# EAGLE design StepTruck_Esquematico (EAGLE 9.6.2)
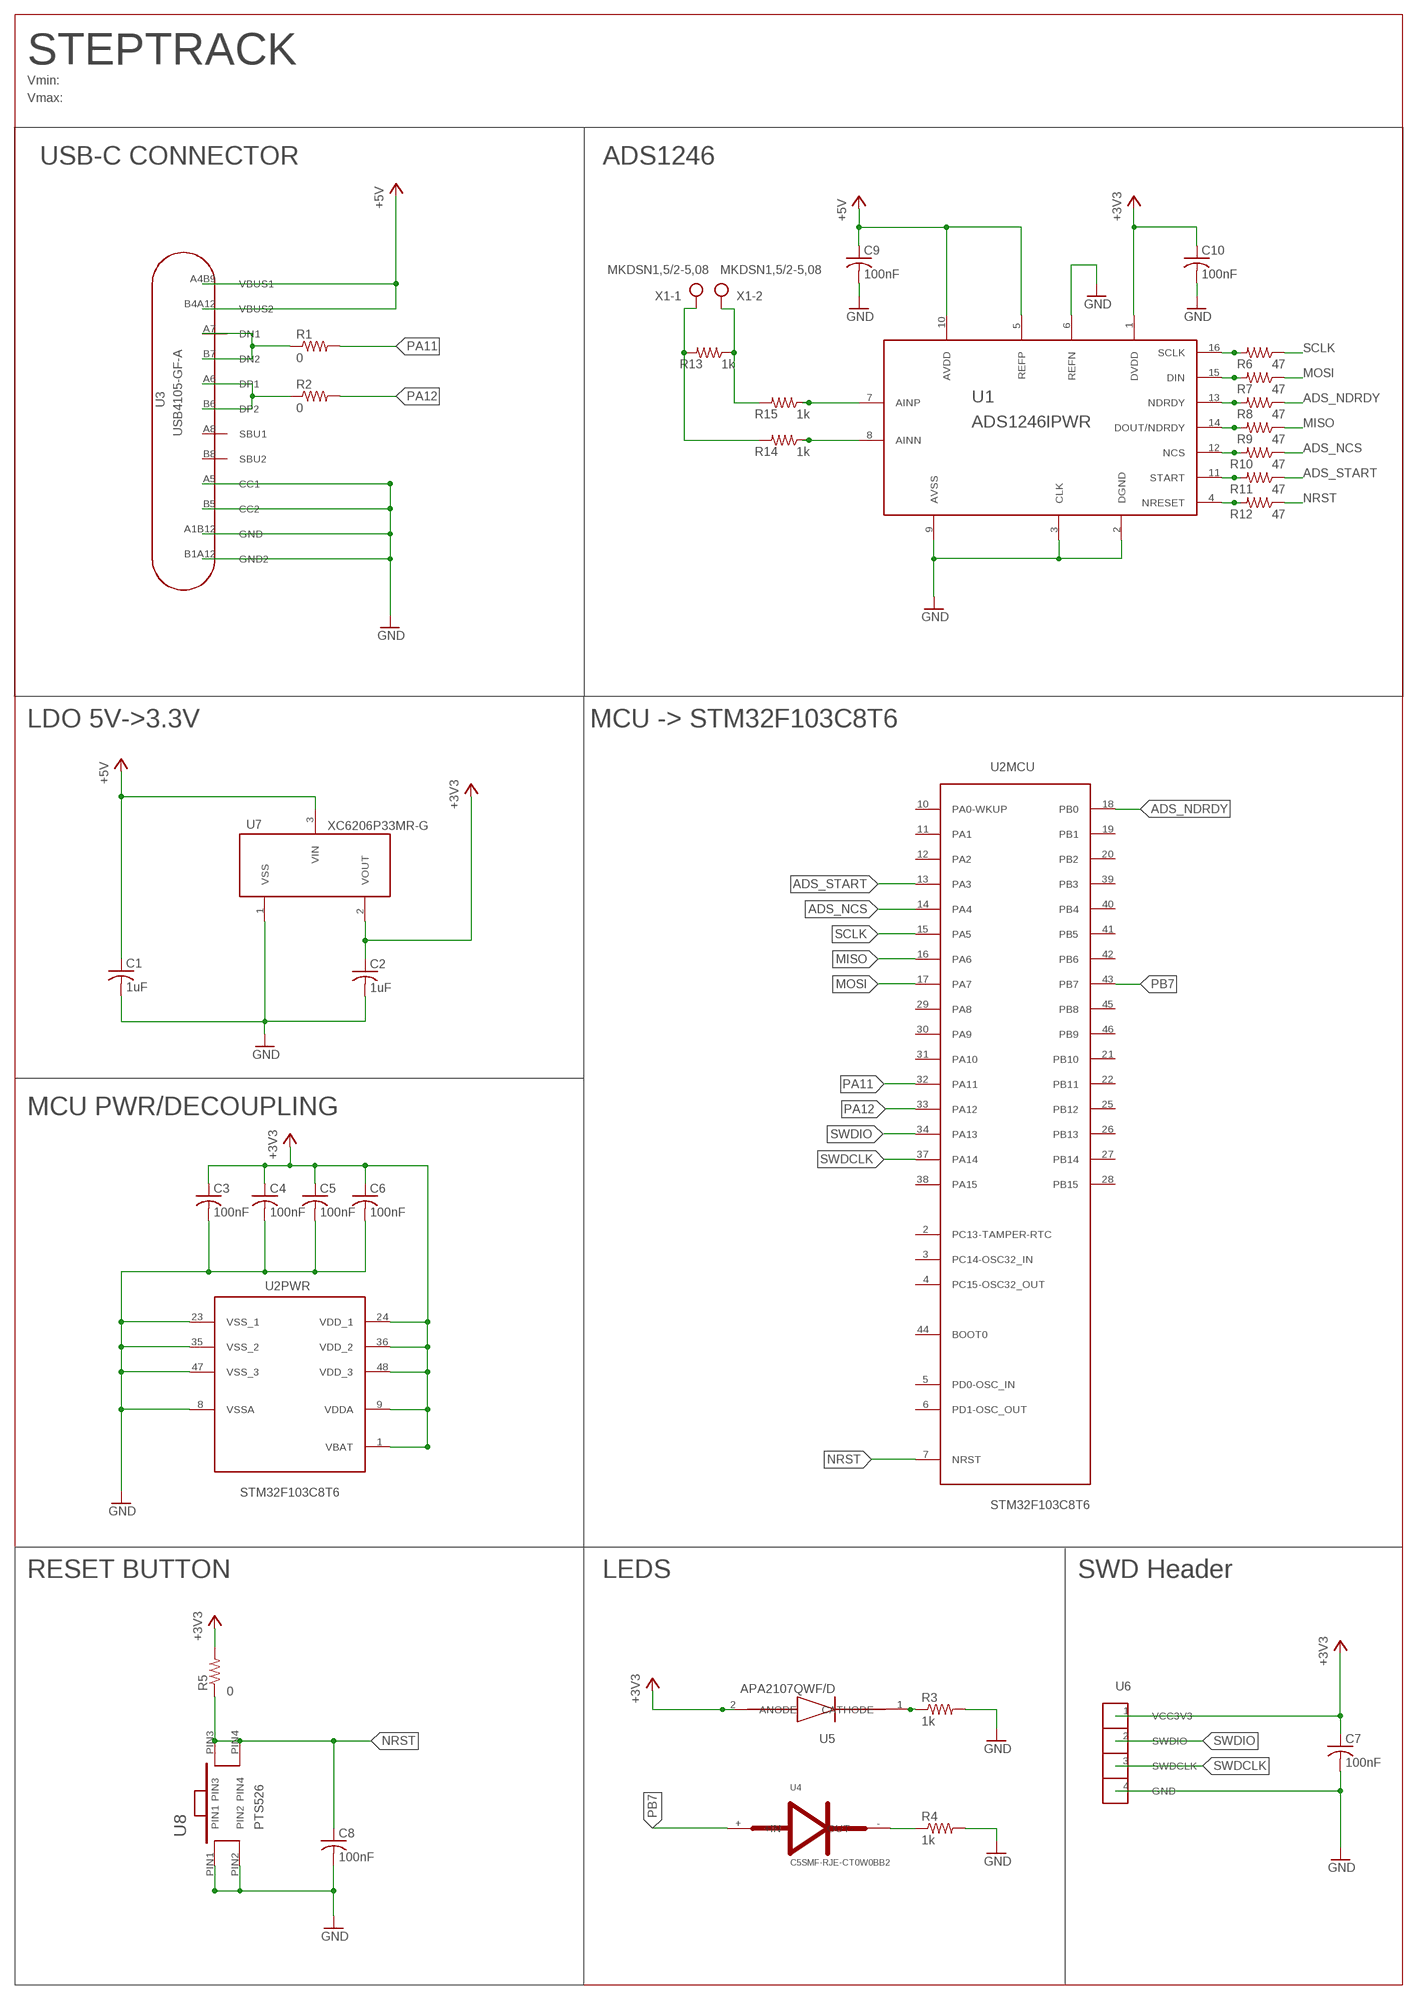
[diagram p0: schematic, sheet 1]

## Parts
C1  1uF  C-USC0805K  [C0805K]
C2  1uF  C-USC0805K  [C0805K]
C3  100nF  C-USC0805K  [C0805K]
C4  100nF  C-USC0805K  [C0805K]
C5  100nF  C-USC0805K  [C0805K]
C6  100nF  C-USC0805K  [C0805K]
C7  100nF  C-USC0805K  [C0805K]
C8  100nF  C-USC0805K  [C0805K]
C9  100nF  C-USC0805K  [C0805K]
C10  100nF  C-USC0805K  [C0805K]
R1  0  R-US_R0805  [R0805]
R2  0  R-US_R0805  [R0805]
R3  1k  R-US_R0805  [R0805]
R4  1k  R-US_R0805  [R0805]
R5  0  R-US_R0805  [R0805]
R6  47  R-US_R0805  [R0805]
R7  47  R-US_R0805  [R0805]
R8  47  R-US_R0805  [R0805]
R9  47  R-US_R0805  [R0805]
R10  47  R-US_R0805  [R0805]
R11  47  R-US_R0805  [R0805]
R12  47  R-US_R0805  [R0805]
R13  1k  R-US_R0805  [R0805]
R14  1k  R-US_R0805  [R0805]
R15  1k  R-US_R0805  [R0805]
U1  ADS1246IPWR  [ADS1246IPWR]
U2  STM32F103C8T6  [48-LQFP]
U3  USB4105-GF-A  [USB4105-GF-A]
U4  C5SMF-RJE-CT0W0BB2  [C5SMF-RJE-CT0W0BB2]
U5  APA2107QWF/D  [APA2107QWF/D]
U6  TS104TAA  [TS-104-T-AA]
U7  XC6206P33MR-G  [SOT-23]
U8  PTS526  [PTS526]
X1  MKDSN1,5/2-5,08  [MKDSN1,5/2-5,08]

## Nets
+3V3: C2.1 C3.1 C4.1 C5.1 C6.1 C7.1 C10.1 R5.2 U1.1(DVDD) U2.1(PWR:VBAT) U2.9(PWR:VDDA) U2.24(PWR:VDD_1) U2.36(PWR:VDD_2) U2.48(PWR:VDD_3) U5.2(ANODE) U6.1(VCC3V3) U7.2(VOUT)
+5V: C1.1 C9.1 U1.5(REFP) U1.10(AVDD) U3.A4B9(VBUS1) U3.B4A12(VBUS2) U7.3(VIN)
ADS_NCS: R10.1 U2.14(MCU:PA4)
ADS_NDRDY: R8.1 U2.18(MCU:PB0)
ADS_START: R11.1 U2.13(MCU:PA3)
GND: C1.2 C2.2 C3.2 C4.2 C5.2 C6.2 C7.2 C8.2 C9.2 C10.2 R3.2 R4.2 U1.2(DGND) U1.3(CLK) U1.6(REFN) U1.9(AVSS) U2.8(PWR:VSSA) U2.23(PWR:VSS_1) U2.35(PWR:VSS_2) U2.47(PWR:VSS_3) U3.A1B12(GND) U3.A5(CC1) U3.B1A12(GND2) U3.B5(CC2) U6.4(GND) U7.1(VSS) U8.PIN1 U8.PIN2
MISO: R9.1 U2.16(MCU:PA6)
MOSI: R7.1 U2.17(MCU:PA7)
N$1: R1.1 U3.A7(DN1) U3.B7(DN2)
N$2: R15.1 U1.7(AINP)
N$3: R2.1 U3.A6(DP1) U3.B6(DP2)
N$4: R14.1 U1.8(AINN)
N$5: R3.1 U5.1(CATHODE)
N$6: R4.1 U4.-(OUT-)
N$7: R12.2 U1.4(NRESET)
N$8: R11.2 U1.11(START)
N$9: R10.2 U1.12(NCS)
N$10: R9.2 U1.14(DOUT/NDRDY)
N$11: R8.2 U1.13(NDRDY)
N$12: R7.2 U1.15(DIN)
N$13: R6.2 U1.16(SCLK)
N$14: R13.2 R14.2 X1.1
N$17: R13.1 R15.2 X1.2
NRST: C8.1 R5.1 R12.1 U2.7(MCU:NRST) U8.PIN3 U8.PIN4
PA11 [New Class]: R1.2 U2.32(MCU:PA11)
PA12: R2.2 U2.33(MCU:PA12)
PB7: U2.43(MCU:PB7) U4.+(+IN)
SCLK [New Class]: R6.1 U2.15(MCU:PA5)
SWDCLK: U2.37(MCU:PA14) U6.3(SWDCLK)
SWDIO: U2.34(MCU:PA13) U6.2(SWDIO)
Unconnected: U2.2(MCU:PC13-TAMPER-RTC) U2.3(MCU:PC14-OSC32_IN) U2.4(MCU:PC15-OSC32_OUT) U2.5(MCU:PD0-OSC_IN) U2.6(MCU:PD1-OSC_OUT) U2.10(MCU:PA0-WKUP) U2.11(MCU:PA1) U2.12(MCU:PA2) U2.19(MCU:PB1) U2.20(MCU:PB2) U2.21(MCU:PB10) U2.22(MCU:PB11) U2.25(MCU:PB12) U2.26(MCU:PB13) U2.27(MCU:PB14) U2.28(MCU:PB15) U2.29(MCU:PA8) U2.30(MCU:PA9) U2.31(MCU:PA10) U2.38(MCU:PA15) U2.39(MCU:PB3) U2.40(MCU:PB4) U2.41(MCU:PB5) U2.42(MCU:PB6) U2.44(MCU:BOOT0) U2.45(MCU:PB8) U2.46(MCU:PB9) U3.A8(SBU1) U3.B8(SBU2)

## Notes on the sheet
- STEPTRACK
- Vmin:
- Vmax:
- USB-C CONNECTOR | ADS1246
- LDO 5V->3.3V | MCU -> STM32F103C8T6
- MCU PWR/DECOUPLING
- RESET BUTTON | LEDS | SWD Header

## Library data of the parts
C1-C10 = rcl:C-US: CAPACITOR, American symbol; SPICEPREFIX: C
R1-R15 = rcl:R-US_: RESISTOR, American symbol; SPICEPREFIX: R
U1 = ADS1246:ADS1246IPWR
U2 = STM32F103C8T6 - STM:STM32F103C8T6
U3 = USB4105:USB4105-GF-A
U4 = LED_ROJO:C5SMF-RJE-CT0W0BB2
U5 = LED_BLANCO:APA2107QWF/D
U6 = SWD:TS104TAA
U7 = XC6206P332MR-G-TS:XC6206P33MR-G
U8 = PTS526:PTS526
X1 = 1729128 - PHOENIX CONTACT:MKDSN1,5/2-5,08: MKDSN 1,5/ 2-5,08 Printklemme Nennstrom: 13,5 A Nennspannung: 250 V Rastermaß: 5,08 mm Polzahl: 2 Anschlussart: Schraubanschluss Montage: Löten Anschlussrichtung Leiter/Platine: 0 ° Artikelnummer: 1729128 Source: http://eshop.phoenixcontact.com .. 1729128.pdf

## Board
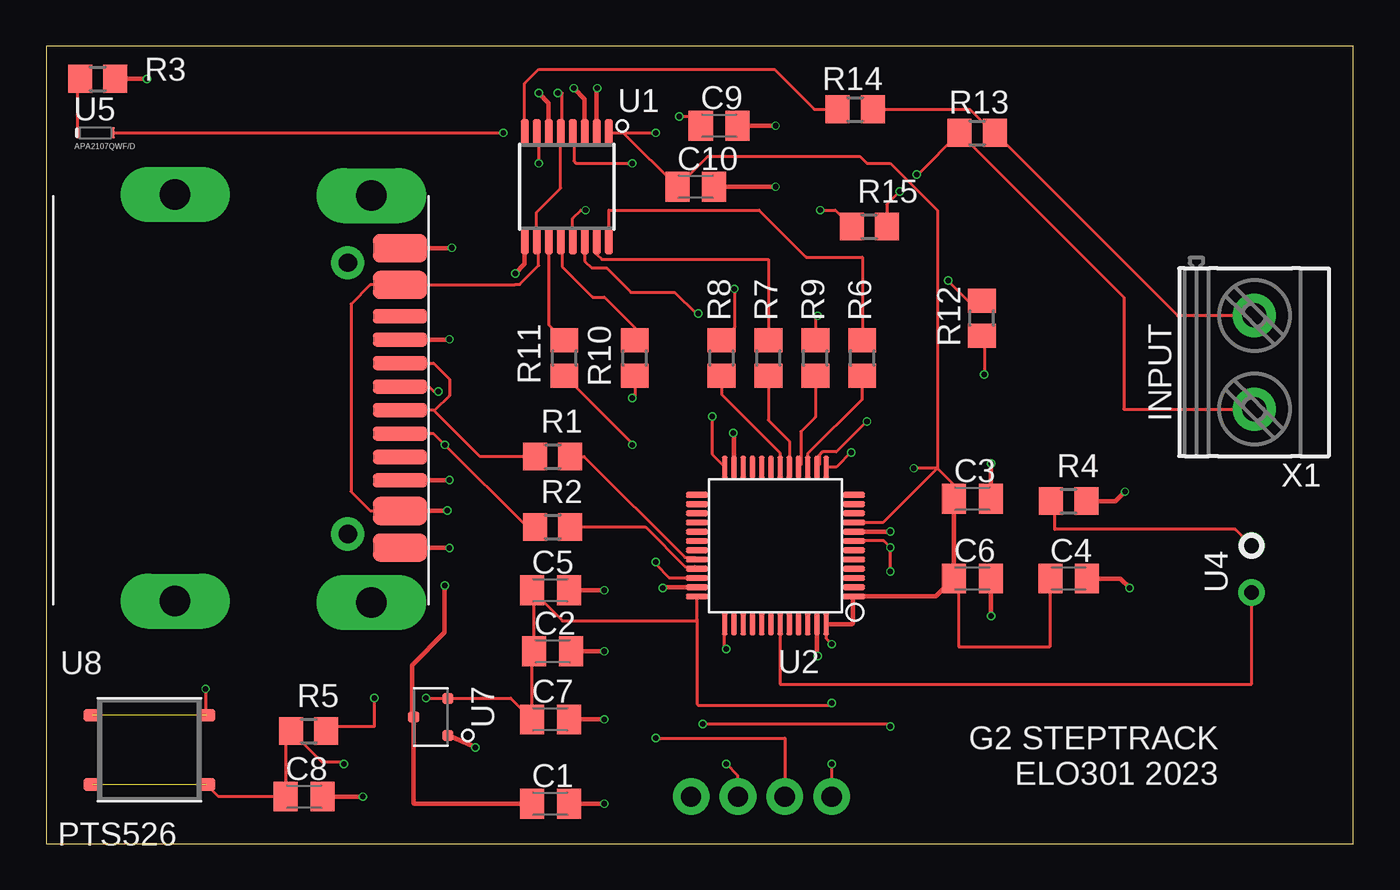
[diagram p1: board, top side]
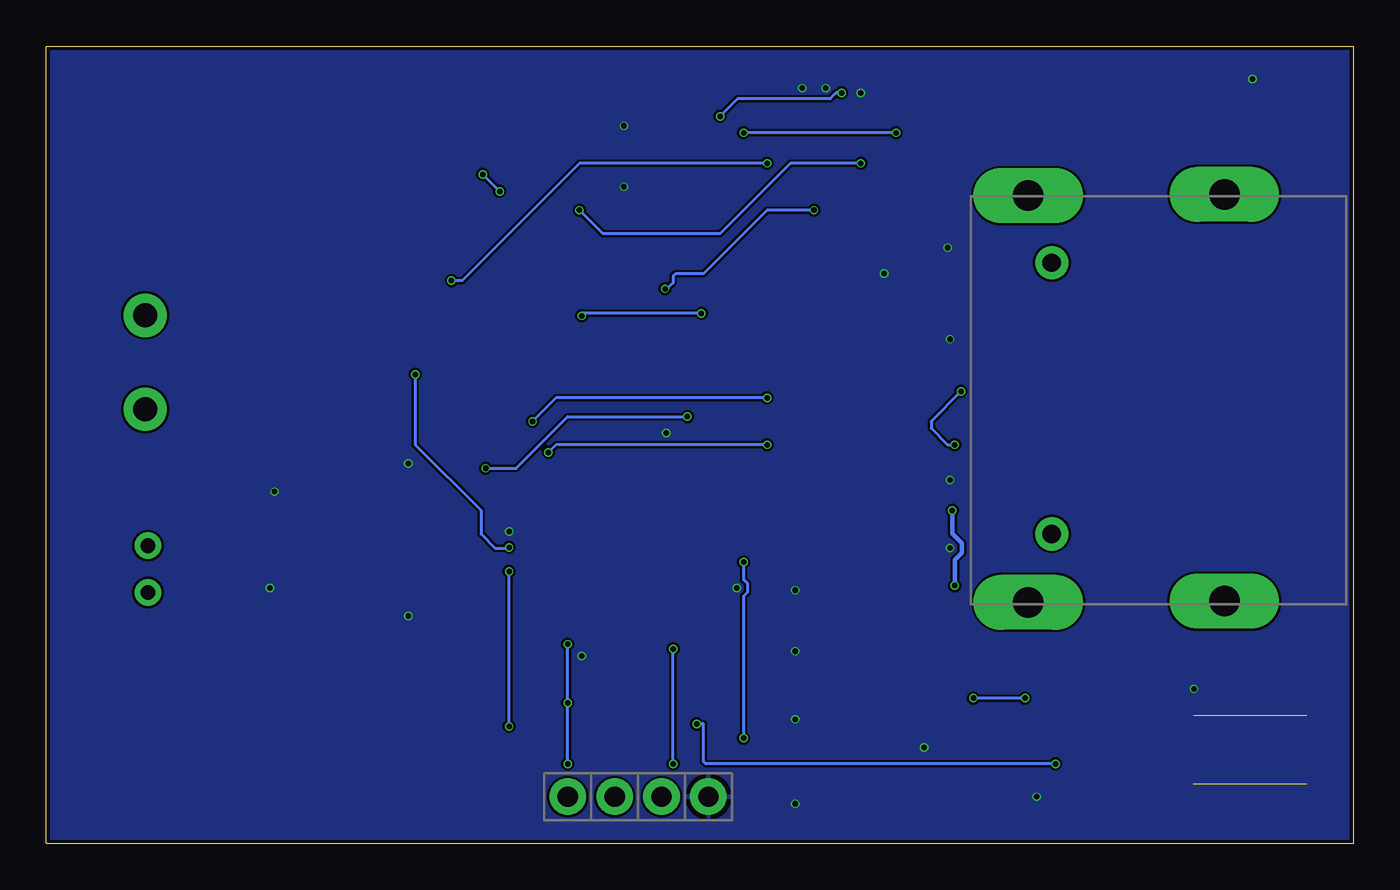
[diagram p2: board, bottom side, seen from below]

Size 70.79 x 43.17 mm. Coordinates in mm from the lower left corner, seen from the top.
Outline: 0,0 70.79,0 70.79,43.17 0,43.17 0,0
Copper layers (1*16): Top 0.035mm / dielectric 1.6mm / Bottom 0.035mm
Design rules "jlcpcb-2layers": minimum track width 5mil, minimum drill 0.3mm, track to track 5mil, track to pad 5mil, pad to pad 5mil, via to via 5mil, smd to smd 5mil, copper to edge 0.2mm, drill to drill 6mil, minimum pad ring 10mil, minimum via ring 3mil, stop-mask expansion 4mil, vias tented up to drill 0mil, thermal gap 10mil

### Footprints (pad centres in the part's own frame; a part is rotated, then mirrored left to right if it is on the bottom)
C0805K = smd 1.3 x 1.6: 1 -1,0; 2 1,0
R0805 = smd 1.3 x 1.5: 1 -0.95,0; 2 0.95,0
ADS1246IPWR = smd 1.5 x 0.45: 1 -2.9,2.275; 2 -2.9,1.625; 3 -2.9,0.975; 4 -2.9,0.325; 5 -2.9,-0.325; 6 -2.9,-0.975; 7 -2.9,-1.625; 8 -2.9,-2.275; 9 2.9,-2.275; 10 2.9,-1.625; 11 2.9,-0.975; 12 2.9,-0.325; 13 2.9,0.325; 14 2.9,0.975; 15 2.9,1.625; 16 2.9,2.275
48-LQFP = smd 1.2 x 0.3: 1 -4.25,2.75; 2 -4.25,2.25; 3 -4.25,1.75; 4 -4.25,1.25; 5 -4.25,0.75; 6 -4.25,0.25; 7 -4.25,-0.25; 8 -4.25,-0.75; 9 -4.25,-1.25; 10 -4.25,-1.75; 11 -4.25,-2.25; 12 -4.25,-2.75; 25 4.25,-2.75; 26 4.25,-2.25; 27 4.25,-1.75; 28 4.25,-1.25; 29 4.25,-0.75; 30 4.25,-0.25; 31 4.25,0.25; 32 4.25,0.75; 33 4.25,1.25; 34 4.25,1.75; 35 4.25,2.25; 36 4.25,2.75 | smd 0.3 x 1.2: 13 -2.75,-4.25; 14 -2.25,-4.25; 15 -1.75,-4.25; 16 -1.25,-4.25; 17 -0.75,-4.25; 18 -0.25,-4.25; 19 0.25,-4.25; 20 0.75,-4.25; 21 1.25,-4.25; 22 1.75,-4.25; 23 2.25,-4.25; 24 2.75,-4.25; 37 2.75,4.25; 38 2.25,4.25; 39 1.75,4.25; 40 1.25,4.25; 41 0.75,4.25; 42 0.25,4.25; 43 -0.25,4.25; 44 -0.75,4.25; 45 -1.25,4.25; 46 -1.75,4.25; 47 -2.25,4.25; 48 -2.75,4.25
USB4105-GF-A = drill 1.651 pad 1.93 long: 1 -11.024,-2.032; 2 -10.947,8.585; 5 11.074,8.585; 6 10.998,-2.032 | drill 1 pad 1.676: 3 -7.315,7.315; 4 7.366,7.315 | smd 1.524 x 2.921: A1B12 -8.103,10.147; A4B9 -6.121,10.147; B1A12 8.103,10.147; B4A12 6.121,10.147 | smd 0.762 x 2.921: A5 -3.15,10.147; A6 -0.61,10.147; A7 0.66,10.147; A8 3.2,10.147; B5 4.47,10.147; B6 1.93,10.147; B7 -1.88,10.147; B8 -4.42,10.147
C5SMF-RJE-CT0W0BB2 = drill 0.8 pad 1.4: + -1.27,0; - 1.27,0
APA2107QWF/D = smd 0.2 x 0.6: 1 -0.95,0; 2 0.95,0
TS-104-T-AA = drill 1.1 pad 1.85: 1 0,3.81; 2 0,1.27; 3 0,-1.27; 4 0,-3.81
SOT-23 = smd 0.6 x 0.6: 1 -1,-0.93; 2 1,-0.93; 3 0,0.93
PTS526 = smd 1 x 0.7: PIN1 -3.073,1.869; PIN2 3.073,1.869; PIN3 -3.073,-1.869; PIN4 3.073,-1.869
MKDSN1,5/2-5,08 = drill 1.3 pad 2: 1 -2.561,0.025; 2 2.519,0.025

### Placement (x,y rotation side)
C1  27.3,2.16 0 top
C2  27.43,10.41 0 top
C3  50.16,18.67 0 top
C4  55.37,14.35 0 top
C5  27.3,13.72 0 top
C6  50.16,14.35 0 top
C7  27.3,6.73 0 top
C8  13.97,2.54 0 top
C9  36.45,38.86 0 top
C10  35.18,35.56 0 top
R1  27.43,20.95 0 top
R2  27.43,17.14 0 top
R3  2.79,41.4 0 top
R4  55.37,18.54 0 top
R5  14.22,6.1 0 top
R6  44.2,26.29 90 top
R7  39.12,26.29 90 top
R8  36.58,26.29 90 top
R9  41.66,26.29 90 top
R10  31.88,26.29 90 top
R11  28.07,26.29 90 top
R12  50.67,28.45 90 top
R13  50.42,38.48 0 top
R14  43.81,39.75 0 top
R15  44.58,33.4 0 top
U1  28.19,35.56 270 top
U2  39.5,16.13 180 top
U3  9.02,24.13 270 top
U4  65.28,14.86 90 top
U5  2.67,38.48 0 top
U6  38.73,2.54 270 top
U7  20.83,6.86 90 top
U8  5.59,5.08 0 top
X1  65.41,26.03 270 top

### Tracks (layer width: path | path; a pad name or v marks a point on that pad's centre or on a via)
+3V3  (via drill 0.3)
  Top 0.152: 31.28,38.46 C10.1 35.83,37.21 44.07,37.21 44.45,36.83 45.72,36.83 48.26,34.29 48.26,20.32 | 31.28,38.46 U1.1 | 48.26,20.32 49.53,19.05 49.53,19.03 C3.1 | U2.9 45.32,17.38 48.26,20.32 | 48.26,20.32 v46.99,20.32 | U2.24 36.75,20.4 36.07,21.08 v36.07,23.11 | v42.55,10.79 42.25,11.09 U2.48 | U6.1 v42.55,4.32 | C6.1 49.4,14.11 49.4,10.67 54.36,10.67 54.37,10.68 C4.1 | R5.2 15.43,6.35 17.78,6.35 v17.78,7.87 | U5.2 v24.77,38.48 | v33.02,38.48 33,38.46 31.28,38.46 | 35.25,12.13 35.18,12.06 27.96,12.06 C5.1 26.43,13.59 C2.1 26.3,10.29 C7.1 25.16,7.87 23.62,7.87 23.61,7.86 U7.2 21.74,7.87 v20.57,7.87 | 35.25,12.13 U2.36 | 35.25,12.13 35.25,7.55 35.31,7.49 42.55,7.49 v42.55,7.62
  Top 0.254: C3.1 C6.1 48.19,13.38 U2.1 43.69,13.32 43.69,11.94 43.63,11.88 U2.48
  Bottom 0.152: v46.99,20.32 45.34,20.32 42.55,23.11 v36.07,23.11 | v42.55,4.32 v42.55,7.62 v42.55,10.79 | v24.77,38.48 v33.02,38.48 | v17.78,7.87 v20.57,7.87
+5V  (via drill 0.3)
  Top 0.152: v27.72,40.64 27.94,40.64 27.94,38.53 U1.5 27.87,35.49 26.57,34.19 U1.10 26.67,32.56 26.67,31.31 25.64,30.28 25.4,30.28 25.37,30.25 U3.A4B9 17.55,30.25 16.51,29.21 16.51,19.05 17.55,18.01 U3.B4A12 | v34.29,39.37 34.94,39.37 C9.1
  Top 0.254: U3.B4A12 21.69,18.01 v21.72,18.03 | v21.59,13.97 21.59,11.43 19.81,9.65 19.81,6.94 U7.3 19.9,2.2 19.94,2.16 C1.1
  Bottom 0.152: v27.72,40.64 28.01,40.64 28.33,40.31 33.35,40.31 v34.29,39.37
  Bottom 0.254: v21.72,18.03 21.72,16.77 21.21,16.26 21.21,15.74 21.59,15.36 v21.59,13.97
ADS_NCS  (via drill 0.3)
  Top 0.152: R10.1 31.88,24.26 v31.75,24.13 | v44.45,22.86 42.8,21.21 42.05,21.21 41.87,21.03 41.87,20.5 U2.14
  Bottom 0.152: v31.75,24.13 43.18,24.13 v44.45,22.86
ADS_NDRDY
  Top 0.152: R8.1 36.58,24.32 39.75,21.15 U2.18
ADS_START  (via drill 0.3)
  Top 0.152: R11.1 31.75,21.66 v31.75,21.59 | v43.59,21.18 42.79,20.38 U2.13
  Bottom 0.152: v43.59,21.18 43.18,21.59 v31.75,21.59
GND  (via drill 0.3)  (1 unrouted)
  Top 0.152: U8.PIN2 8.66,8.23 8.64,8.25 v8.64,8.38
  Top 0.254: R3.2 v5.46,41.4 | U1.6 27.22,40.09 v26.67,40.64 | U1.3 29.17,40.3 v28.57,40.89 | U1.2 29.82,40.87 v29.84,40.89 | U1.9 25.92,31.38 v25.4,30.86 | C9.2 v39.5,38.86 | C10.2 v39.5,35.56 | U3.A1B12 21.95,32.23 v21.97,32.26 | U3.A5 21.82,27.28 v21.84,27.3 | U3.B5 21.82,19.66 v21.84,19.69 | U3.B1A12 21.82,16.03 v21.84,16 | R4.2 57.91,18.54 v58.42,19.05 | C4.2 58.17,14.35 v58.67,13.84 | C3.2 51.16,20.56 v51.18,20.57 | C6.2 51.16,12.33 v51.18,12.32 | C5.2 v30.23,13.72 | C2.2 v30.23,10.41 | C7.2 v30.23,6.73 | C1.2 v30.23,2.16 | U7.1 23.2,5.25 v23.24,5.21 | C8.2 v17.14,2.54 | U2.23 37.25,22.19 v37.21,22.23 | U2.8 45.71,16.88 v45.72,16.89 | U2.47 41.75,10.2 v41.78,10.16 | U2.35 33.44,13.88 v33.4,13.84
  pour Bottom: 0,43.18 69.85,43.18 70.74,43.18 70.87,43.05 70.87,0 70.99,-0.13 0,-0.13
MISO
  Top 0.152: U2.16 40.87,20.5 40.87,22.3 41.66,23.09 R9.1
MOSI
  Top 0.152: R7.1 39.12,22.93 40.25,21.8 U2.17
N$1
  Top 0.152: R1.1 23.5,20.95 21.02,23.43 | U3.A7 20.98,23.47 21.02,23.43 | U3.B7 20.98,26.01 21.84,25.15 21.84,24.26 21.02,23.43
N$2  (via drill 0.3)
  Top 0.152: U1.7 26.67,38.36 v26.67,36.83 | v41.91,34.29 42.74,34.29 R15.1
  Bottom 0.152: v26.67,36.83 30.48,36.83 34.29,33.02 40.64,33.02 v41.91,34.29
N$3  (via drill 0.3)
  Top 0.152: R2.1 26.04,17.14 v21.59,21.59 20.98,22.2 U3.B6 | U3.A6 20.73,24.74 20.99,24.48 v21.24,24.48
  Bottom 0.152: v21.24,24.48 22.86,22.86 22.86,22.48 21.97,21.59 v21.59,21.59
N$4
  Top 0.152: U1.8 25.92,41.16 26.67,41.91 39.44,41.91 41.59,39.75 R14.1
N$5
  Top 0.152: U5.1 1.72,41.27 R3.1
N$6
  Top 0.152: R4.1 54.61,18.35 54.61,17.02 64.39,17.02 U4.-
N$7  (via drill 0.3)
  Top 0.152: U1.4 28.57,38.4 28.57,36.96 28.7,36.83 v31.75,36.83 | v48.84,30.48 49.92,29.4 R12.2
  Bottom 0.152: v31.75,36.83 41.91,36.83 48.26,30.48 v48.84,30.48
N$8
  Top 0.152: U1.11 27.22,28.09 R11.2
N$9
  Top 0.152: U1.12 27.94,32.59 27.94,31.24 29.59,29.59 30.23,29.59 31.88,27.94 R10.2
N$10  (via drill 0.3)
  Top 0.152: U1.14 29.17,31.54 29.54,31.17 30.35,31.17 31.67,29.84 34.04,29.84 35.18,28.7 v35.31,28.7 | v41.78,28.57 41.66,28.45 R9.2
  Bottom 0.152: v35.31,28.7 41.78,28.7 v41.78,28.57
N$11  (via drill 0.3)
  Top 0.152: U1.13 28.52,33.85 28.96,34.29 v29.21,34.29 | v37.27,30.04 37.27,27.94 R8.2
  Bottom 0.152: v29.21,34.29 31.75,34.29 35.18,30.86 36.7,30.86 36.83,30.73 36.83,30.35 37.21,29.97 v37.27,30.04
N$12
  Top 0.152: U1.15 29.82,31.9 30.1,31.62 39.12,31.62 R7.2
N$13
  Top 0.152: U1.16 30.48,32.67 30.48,34.29 38.61,34.29 41.15,31.75 44.2,31.75 R6.2
N$14
  Top 0.152: R14.2 50.04,39.75 51.31,38.48 R13.2 61.27,28.57 65.41,28.57 X1.1
N$17  (via drill 0.3)
  Top 0.152: v47.15,36.23 47.12,36.2 47.18,36.2 R13.1 58.36,29.59 58.36,23.52 X1.2 | v46.23,35.31 45.53,34.6 R15.2
  Bottom 0.152: v47.15,36.23 v46.23,35.31
NRST  (via drill 0.3)  (1 unrouted)
  Top 0.152: U8.PIN4 9.33,2.54 C8.1 12.97,5.79 R5.1 14.93,4.45 16,4.45 v16.13,4.32 | R12.1 50.8,27.37 v50.8,25.4 | v35.56,6.48 45.59,6.48 v45.72,6.35 | v45.72,14.73 v45.72,16.03 45.37,16.38 U2.7
  Bottom 0.152: v50.8,25.4 50.8,21.59 47.24,18.03 47.24,16.76 46.48,16 45.75,16 v45.72,16.03 | v16.13,4.32 35.05,4.32 35.18,4.45 35.18,6.48 v35.56,6.48 | v45.72,6.35 v45.72,14.73
PA11
  Top 0.152: U2.32 35.13,15.5 34.6,15.5 29.14,20.95 R1.2
PA12
  Top 0.152: U2.33 35.13,15 34.6,15 32.45,17.14 R2.2
PB7
  Top 0.152: U2.43 39.75,8.64 65.28,8.64 U4.+
SCLK
  Top 0.152: U2.15 41.25,21.12 44.2,24.07 R6.1
SWDCLK  (via drill 0.3)
  Top 0.152: U6.3 37.47,3.68 v36.83,4.32 | v36.83,10.54 36.75,10.62 U2.37
  Bottom 0.152: v36.83,4.32 v36.83,10.54
SWDIO  (via drill 0.3)
  Top 0.152: U2.34 33.75,14.38 33.02,15.11 v33.02,15.24 | v33.02,5.71 40.01,5.71 U6.2
  Bottom 0.152: v33.02,15.24 33.02,14.28 32.82,14.08 32.82,13.6 33.02,13.4 v33.02,5.71

### Text on the board
tPlace: INPUT | G2 STEPTRACK / ELO301 2023